# EAGLE design two digits pcb (EAGLE 9.0.0)
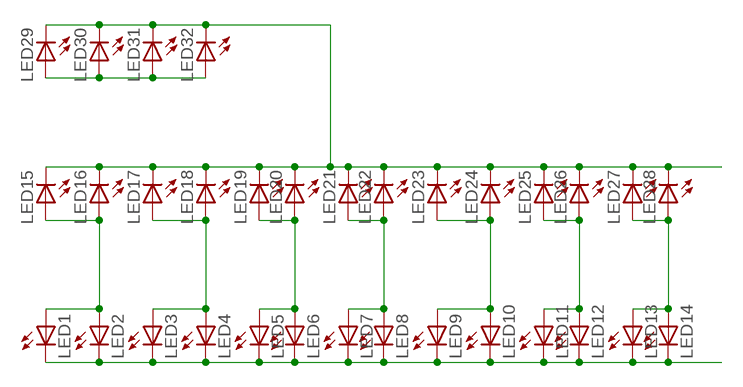
[diagram p0: schematic, sheet 1]

## Parts
LED1  LED5MM  [LED5MM]
LED2  LED5MM  [LED5MM]
LED3  LED5MM  [LED5MM]
LED4  LED5MM  [LED5MM]
LED5  LED5MM  [LED5MM]
LED6  LED5MM  [LED5MM]
LED7  LED5MM  [LED5MM]
LED8  LED5MM  [LED5MM]
LED9  LED5MM  [LED5MM]
LED10  LED5MM  [LED5MM]
LED11  LED5MM  [LED5MM]
LED12  LED5MM  [LED5MM]
LED13  LED5MM  [LED5MM]
LED14  LED5MM  [LED5MM]
LED15  LED5MM  [LED5MM]
LED16  LED5MM  [LED5MM]
LED17  LED5MM  [LED5MM]
LED18  LED5MM  [LED5MM]
LED19  LED5MM  [LED5MM]
LED20  LED5MM  [LED5MM]
LED21  LED5MM  [LED5MM]
LED22  LED5MM  [LED5MM]
LED23  LED5MM  [LED5MM]
LED24  LED5MM  [LED5MM]
LED25  LED5MM  [LED5MM]
LED26  LED5MM  [LED5MM]
LED27  LED5MM  [LED5MM]
LED28  LED5MM  [LED5MM]
LED29  LED5MM  [LED5MM]
LED30  LED5MM  [LED5MM]
LED31  LED5MM  [LED5MM]
LED32  LED5MM  [LED5MM]

## Nets
N$1: LED1.K(C) LED2.K(C) LED3.K(C) LED4.K(C) LED5.K(C) LED6.K(C) LED7.K(C) LED8.K(C) LED9.K(C) LED10.K(C) LED11.K(C) LED12.K(C) LED13.K(C) LED14.K(C)
N$10: LED1.A LED2.A LED15.A LED16.A
N$11: LED3.A LED4.A LED17.A LED18.A
N$12: LED5.A LED6.A LED19.A LED20.A
N$13: LED7.A LED8.A LED21.A LED22.A
N$14: LED9.A LED10.A LED23.A LED24.A
N$15: LED11.A LED12.A LED25.A LED26.A
N$16: LED13.A LED14.A LED27.A LED28.A
N$17: LED15.K(C) LED16.K(C) LED17.K(C) LED18.K(C) LED19.K(C) LED20.K(C) LED21.K(C) LED22.K(C) LED23.K(C) LED24.K(C) LED25.K(C) LED26.K(C) LED27.K(C) LED28.K(C) LED29.K(C) LED30.K(C) LED31.K(C) LED32.K(C)
N$18: LED29.A LED30.A LED31.A LED32.A

## Library data of the parts
LED1-LED32 = led:LED: LED OSRAM: - CHIPLED LG R971, LG N971, LY N971, LG Q971, LY Q971, LO R971, LY R971 LH N974, LH R974 LS Q976, LO Q976, LY Q976 LO Q996 - Hyper CHIPLED LW Q18S LB Q993, LB Q99A, LB R99A - SideLED LS A670, LO A670, LY A670, LG A670, LP A670 LB A673, LV A673, LT A673, LW A673 LH A674 LY A675 LS A676, LA A676, LO A676, LY A676, LW A676 LS A679, LY A679, LG A679 - Hyper Micro SIDELED® LS Y876, LA Y876, LO Y876, LY Y876 LT Y87S - SmartLED LW L88C, LW L88S LB L89C, LB L89S, LG L890 LS L89K, LO L89K, LY L89K LS L896, LA L896, LO L896, LY L896 - TOPLED LS T670, LO T670, LY T670, LG T670, LP T670 LSG T670, LSP T670, LSY T670, LOP T670, LYG T670 LG T671, LOG T671, LSG T671 LB T673, LV T673, LT T673, LW T673 LH T674 LS T676, LA T676, LO T676, LY T676, LB T676, LH T676, LSB T676, LW T676 LB T67C, LV T67C, LT T67C, LS T67K, LO T67K, LY T67K, LW E67C LS E67B, LA E67B, LO E67B, LY E67B, LB E67C, LV E67C, LT E67C LW T67C LS T679, LY T679, LG T679 LS T770, LO T770, LY T770, LG T770, LP T770 LB T773, LV T773, LT T773, LW T773 LH T774 LS E675, LA E675, LY E675, LS T675 LS T776, LA T776, LO T776, LY T776, LB T776 LHGB T686 LT T68C, LB T68C - Hyper Mini TOPLED® LB M676 - Mini TOPLED Santana® LG M470 LS M47K, LO M47K, LY M47K Source: http://www.osram.convergy.de LUXEON: - LUMILED® LXK2-PW12-R00, LXK2-PW12-S00, LXK2-PW14-U00, LXK2-PW14-V00 LXK2-PM12-R00, LXK2-PM12-S00, LXK2-PM14-U00 LXK2-PE12-Q00, LXK2-PE12-R00, LXK2-PE12-S00, LXK2-PE14-T00, LXK2-PE14-U00 LXK2-PB12-K00, LXK2-PB12-L00, LXK2-PB12-M00, LXK2-PB14-N00, LXK2-PB14-P00, LXK2-PB14-Q00 LXK2-PR12-L00, LXK2-PR12-M00, LXK2-PR14-Q00, LXK2-PR14-R00 LXK2-PD12-Q00, LXK2-PD12-R00, LXK2-PD12-S00 LXK2-PH12-R00, LXK2-PH12-S00 LXK2-PL12-P00, LXK2-PL12-Q00, LXK2-PL12-R00 Source: www.luxeon.com KINGBRIGHT: KA-3528ASYC Source: www.kingbright.com

## Board
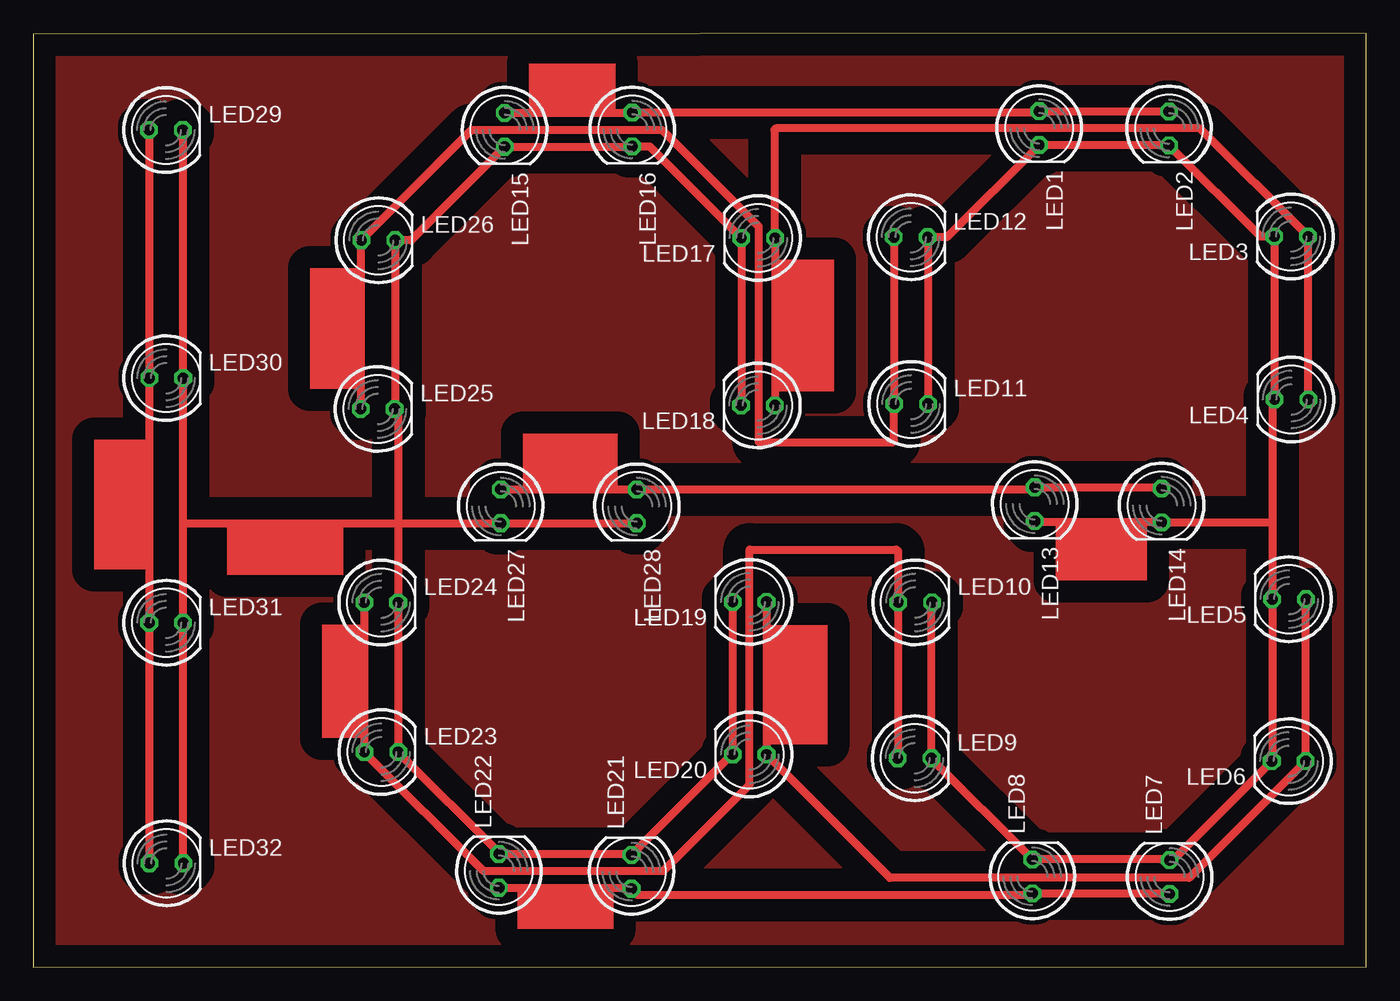
[diagram p1: board, top side]

Size 99.97 x 70.04 mm. Coordinates in mm from the lower left corner, seen from the top.
Outline: 0,0 99.97,0.05 99.97,70.04 0,69.99 0,0
Copper layers (1*16): Top 0.035mm / dielectric 1.5mm / Bottom 0.035mm
Design rules "default": minimum track width 6mil, minimum drill 0.35mm, track to track 6mil, track to pad 6mil, pad to pad 6mil, via to via 6mil, smd to smd 6mil, copper to edge 40mil, drill to drill 6mil, minimum pad ring 10mil, minimum via ring 8mil, stop-mask expansion 4mil, vias tented up to drill 0mil, thermal gap 10mil

### Footprints (pad centres in the part's own frame; a part is rotated, then mirrored left to right if it is on the bottom)
LED5MM = drill 0.813 octagon: A -1.27,0; K 1.27,0

### Placement (x,y rotation side)
LED1  75.44,62.94 270 top
LED2  85.18,62.91 270 top
LED3  94.34,54.81 180 top
LED4  94.37,42.58 180 top
LED5  94.19,27.61 180 top
LED6  94.16,15.47 180 top
LED7  85.23,6.78 90 top
LED8  74.93,6.83 90 top
LED9  66.1,15.69 0 top
LED10  66.13,27.38 0 top
LED11  65.83,42.26 0 top
LED12  65.81,54.76 0 top
LED13  75.11,34.74 270 top
LED14  84.63,34.64 270 top
LED15  35.35,62.81 270 top
LED16  44.92,62.84 270 top
LED17  54.37,54.69 180 top
LED18  54.34,42.14 180 top
LED19  53.72,27.41 180 top
LED20  53.72,15.97 180 top
LED21  44.87,7.18 90 top
LED22  34.92,7.25 90 top
LED23  26.1,16.15 0 top
LED24  26.09,27.36 0 top
LED25  25.82,41.88 0 top
LED26  25.87,54.53 0 top
LED27  35.06,34.58 270 top
LED28  45.27,34.58 270 top
LED29  9.94,62.79 0 top
LED30  9.97,44.19 0 top
LED31  9.96,25.85 0 top
LED32  9.98,7.81 0 top

### Tracks (layer width: path | path; a pad name or v marks a point on that pad's centre or on a via)
N$1
  Top 0.61: LED11.K 67.08,42.28 LED12.K 68.53,54.76 LED1.K 75.46,61.64 LED2.K 92.01,54.81 LED3.K 93.07,42.61 LED4.K 92.92,42.4 92.92,33.27 | LED13.K 75.21,33.37 LED14.K 92.82,33.37 92.92,33.27 | LED10.K 67.37,27.34 LED9.K 67.37,15.66 LED8.K 85.18,8.1 LED7.K 85.47,8.05 LED6.K 92.92,15.5 LED5.K 92.92,33.27
N$2
  pour Top (isolate 1.676): -0.01,69.97 -0.01,-0.03 99.99,-0.03 99.99,69.97
N$10
  Top 0.61: LED15.A 44.89,64.08 | LED2.A 85.15,64.21 LED1.A 75.34,64.11 LED16.A
  Top 1.016: 44.89,64.08 LED16.A
N$11
  Top 0.61: LED18.A 55.64,42.16 LED17.A 55.59,54.74 55.59,62.81 55.69,62.91 87.51,62.91 LED3.A 95.64,54.78 LED4.A
N$12
  Top 0.61: LED19.A LED20.A | LED20.A | LED5.A 95.43,27.59 LED6.A 86.69,6.73 64.24,6.73 LED20.A
N$13
  Top 0.61: LED22.A 44.79,5.98 LED21.A 44.87,5.84 45.25,5.46 74.94,5.46 75.04,5.56 | LED8.A 75.04,5.56 | 75.04,5.56 85.18,5.56 LED7.A
N$14
  Top 0.61: LED24.A LED23.A 33.74,7.23 47.25,7.23 53.73,13.72 53.73,31.34 64.73,31.34 64.86,31.21 LED10.A 64.86,15.72 LED9.A
N$15
  Top 0.61: LED25.A 24.55,54.48 LED26.A 32.88,62.81 47.15,62.81 54.39,55.56 54.39,39.39 64.5,39.39 64.58,39.47 64.54,39.5 64.54,42.28 | LED12.A 64.54,42.28 | 64.54,42.28 LED11.A
N$16
  Top 0.61: LED27.A LED28.A 74.95,35.85 LED13.A 84.53,36.01 LED14.A
N$17
  Top 0.61: LED18.K 53.1,42.16 LED17.K 46.25,61.54 44.89,61.54 LED15.K 28.34,54.53 LED26.K 27.14,41.93 LED25.K 27.36,41.61 27.36,33.27 | LED28.K LED27.K 35.02,33.27 27.36,33.27 | LED19.K LED20.K | LED20.K | LED22.K 35,8.52 | LED32.K 11.25,25.83 LED31.K 11.23,33.3 | 11.23,33.3 LED30.K 11.24,62.77 LED29.K | 27.36,33.27 LED24.K LED23.K 35,8.52 | 35,8.52 44.79,8.52 LED21.K 52.4,15.97 LED20.K | 27.36,33.27 11.26,33.27 11.23,33.3
  Top 1.016: 44.89,61.54 LED16.K
N$18
  Top 0.61: LED29.A 8.7,62.77 LED30.A LED31.A 8.69,7.83 LED32.A
(copper drawn outside any net)
  shapes: Top area x10